# Altium project dspic30f2023_Dev_Board.PrjPcb
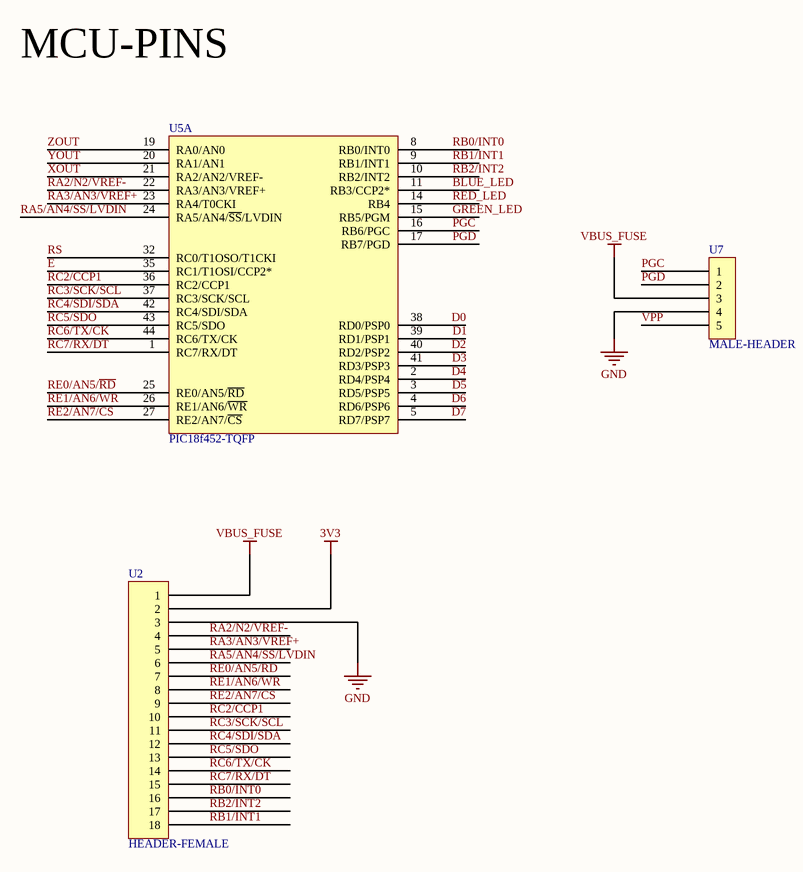
[diagram p0: MCU-PINS.SchDoc]
2 sheets, 24 parts. Net scope: global (net labels, ports and power ports of the same name join across sheets).
Board file: dspic30f2023.PcbDoc
Sheets:
  MCU-PINS.SchDoc
  Sensor&Screen.SchDoc

## Sheet MCU-PINS.SchDoc
size A; SheetNumber: 2; SheetTotal: 3

### Parts
U2  HEADER-FEMALE  [PCBComponent_1]
U5  PIC18f452-TQFP  [PCBComponent_1]  (part A of 2)
U7  MALE-HEADER  [PCBComponent_1]

### Nets
3V3: U2.2
GND: U2.3 U7.4
VBUS_FUSE: U2.1 U7.3
BLUE_LED: U5.11(RB3/CCP2*)
D0: U5.38(RD0/PSP0)
D1: U5.39(RD1/PSP1)
D2: U5.40(RD2/PSP2)
D3: U5.41(RD3/PSP3)
D4: U5.2(RD4/PSP4)
D5: U5.3(RD5/PSP5)
D6: U5.4(RD6/PSP6)
D7: U5.5(RD7/PSP7)
E: U5.35(RC1/T1OSI/CCP2*)
GREEN_LED: U5.15(RB5/PGM)
PGC: U5.16(RB6/PGC) U7.1
PGD: U5.17(RB7/PGD) U7.2
RA2/N2/VREF-: U2.4 U5.22(RA3/AN3/VREF+)
RA3/AN3/VREF+: U2.5 U5.23(RA4/T0CKI)
RA5/AN4/~{SS}/LVDIN: U2.6 U5.24(RA5/AN4/~{SS}/LVDIN)
RB0/INT0: U2.16 U5.8(RB0/INT0)
RB1/INT1: U2.18 U5.9(RB1/INT1)
RB2/INT2: U2.17 U5.10(RB2/INT2)
RC2/CCP1: U2.10 U5.36(RC2/CCP1)
RC3/SCK/SCL: U2.11 U5.37(RC3/SCK/SCL)
RC4/SDI/SDA: U2.12 U5.42(RC4/SDI/SDA)
RC5/SDO: U2.13 U5.43(RC5/SDO)
RC6/TX/CK: U2.14 U5.44(RC6/TX/CK)
RC7/RX/DT: U2.15 U5.1(RC7/RX/DT)
RE0/AN5/~{RD}: U2.7 U5.25(RE0/AN5/~{RD})
RE1/AN6/~{WR}: U2.8 U5.26(RE1/AN6/~{WR})
RE2/AN7/~{CS}: U2.9 U5.27(RE2/AN7/~{CS})
RED_LED: U5.14(RB4)
RS: U5.32(RC0/T1OSO/T1CKI)
VPP: U7.5
XOUT: U5.21(RA2/AN2/VREF-)
YOUT: U5.20(RA1/AN1)
ZOUT: U5.19(RA0/AN0)

### Notes on the sheet
- MCU-PINS

### Library data of the parts
U2 = L-KLS1-208B-4.0-1-18-S
U7 = 5-PINS-MALE-HEADER

## Sheet Sensor&Screen.SchDoc
size A; SheetNumber: 3; SheetTotal: 3
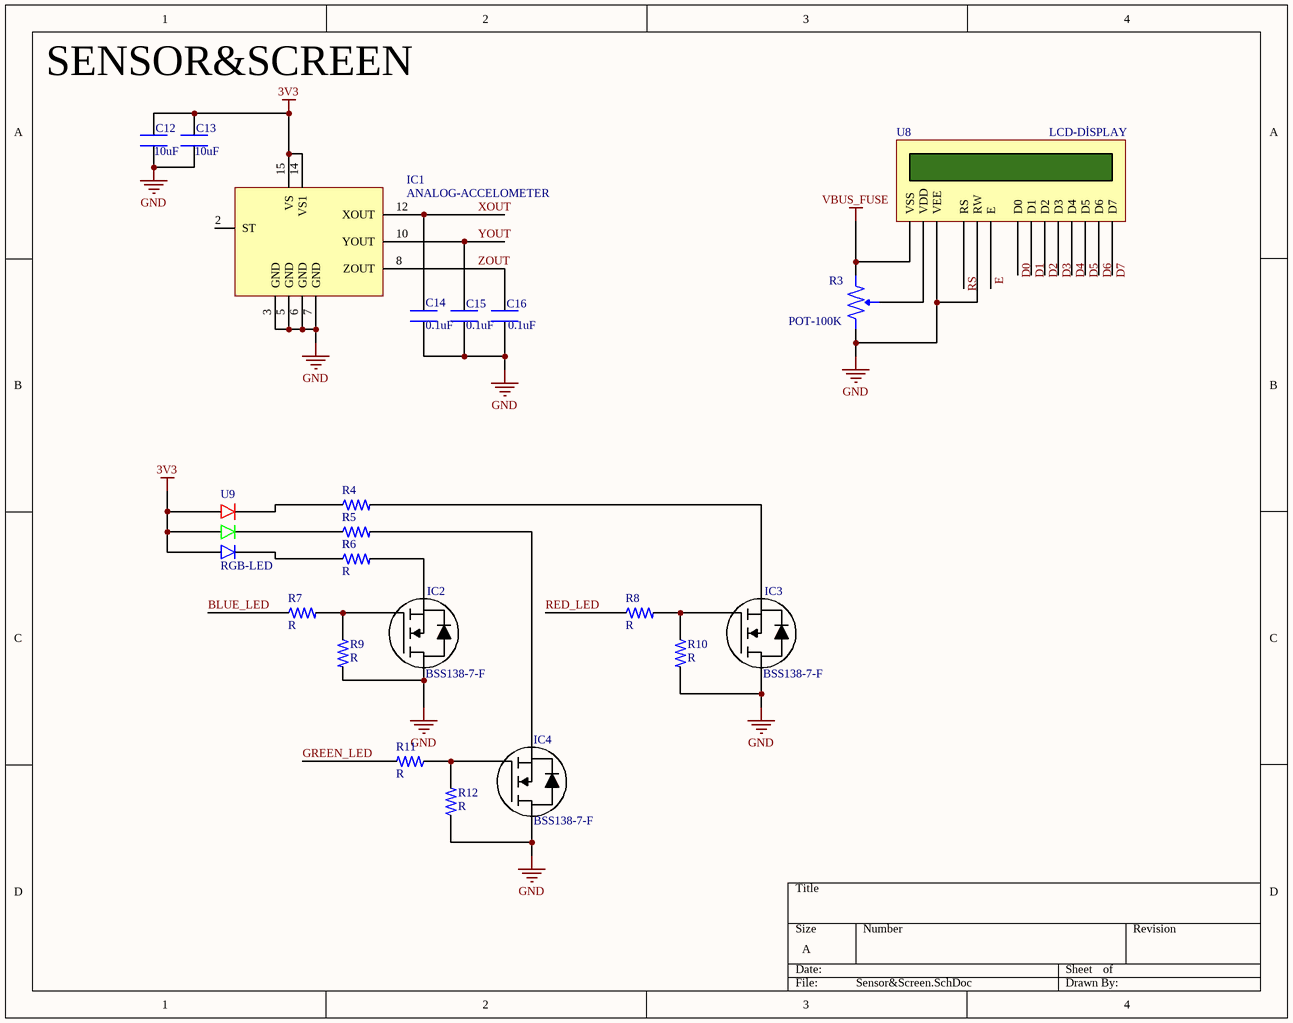
[diagram p1: Sensor&Screen.SchDoc]

### Parts
C12  10uF  [PCBComponent_1]
C13  10uF  [PCBComponent_1]
C14  0.1uF  [PCBComponent_1]
C15  0.1uF  [PCBComponent_1]
C16  0.1uF  [PCBComponent_1]
IC1  ANALOG-ACCELOMETER  [PCBComponent_1]
IC2  BSS138-7-F  [PCBComponent_1]
IC3  BSS138-7-F  [PCBComponent_1]
IC4  BSS138-7-F  [PCBComponent_1]
R3  POT-100K  [PCBComponent_1]
R4  R  [PCBComponent_1]
R5  R  [PCBComponent_1]
R6  R  [PCBComponent_1]
R7  R  [PCBComponent_1]
R8  R  [PCBComponent_1]
R9  R  [PCBComponent_1]
R10  R  [PCBComponent_1]
R11  R  [PCBComponent_1]
R12  R  [PCBComponent_1]
U8  LCD-DİSPLAY  [PCBComponent_1]
U9  RGB-LED  [PCBComponent_1]

### Nets
3V3: C12.2 C13.2 IC1.14(VS1) IC1.15(VS) U9.4(R) U9.5(G) U9.6(B)
GND: C12.1 C13.1 C14.1 C15.1 C16.1 IC1.3(GND) IC1.5(GND) IC1.6(GND) IC1.7(GND) IC2.3(SOURCE) IC3.3(SOURCE) IC4.3(SOURCE) R3.3 R9.2 R10.2 R12.1 U8.3(VEE) U8.5(RW)
VBUS_FUSE: R3.1 U8.1(VSS)
BLUE_LED: R7.1
D0: U8.7(D0)
D1: U8.8(D1)
D2: U8.9(D2)
D3: U8.10(D3)
D4: U8.11(D4)
D5: U8.12(D5)
D6: U8.13(D6)
D7: U8.14(D7)
E: U8.6(E)
GREEN_LED: R11.2
RED_LED: R8.1
RS: U8.4(RS)
XOUT: C14.2 IC1.12(XOUT)
YOUT: C15.2 IC1.10(YOUT)
ZOUT: C16.2 IC1.8(ZOUT)
NetIC2_1: IC2.1(GATE) R7.2 R9.1
NetIC2_2: IC2.2(DRAİN) R6.2
NetIC3_1: IC3.1(GATE) R8.2 R10.1
NetIC3_2: IC3.2(DRAİN) R4.2
NetIC4_1: IC4.1(GATE) R11.1 R12.2
NetIC4_2: IC4.2(DRAİN) R5.2
NetR3_2: R3.2 U8.2(VDD)
NetR4_1: R4.1 U9.3
NetR5_1: R5.1 U9.2
NetR6_1: R6.1 U9.1

Not connected (* = marked no-connect by the designer): IC1 2(ST)

### Notes on the sheet
- SENSOR&SCREEN

### Library data of the parts
C12-C16 = 1206-CAPACİTOR
IC1 = ADXL33X
IC2-IC4 = Component_1
R3 = L-KLS4-R0902N-B100K-L25-
R4-R12 = 1206-RESİSTOR
U8 = 0802A
U9 = FYLS-5050NRGB

## Nets that join several sheets
3V3: MCU-PINS (U2.2), Sensor&Screen (7 pins)
GND: MCU-PINS (U2.3 U7.4), Sensor&Screen (18 pins)
VBUS_FUSE: MCU-PINS (U2.1 U7.3), Sensor&Screen (R3.1 U8.1)
BLUE_LED: MCU-PINS (U5.11), Sensor&Screen (R7.1)
D0: MCU-PINS (U5.38), Sensor&Screen (U8.7)
D1: MCU-PINS (U5.39), Sensor&Screen (U8.8)
D2: MCU-PINS (U5.40), Sensor&Screen (U8.9)
D3: MCU-PINS (U5.41), Sensor&Screen (U8.10)
D4: MCU-PINS (U5.2), Sensor&Screen (U8.11)
D5: MCU-PINS (U5.3), Sensor&Screen (U8.12)
D6: MCU-PINS (U5.4), Sensor&Screen (U8.13)
D7: MCU-PINS (U5.5), Sensor&Screen (U8.14)
E: MCU-PINS (U5.35), Sensor&Screen (U8.6)
GREEN_LED: MCU-PINS (U5.15), Sensor&Screen (R11.2)
RED_LED: MCU-PINS (U5.14), Sensor&Screen (R8.1)
RS: MCU-PINS (U5.32), Sensor&Screen (U8.4)
XOUT: MCU-PINS (U5.21), Sensor&Screen (C14.2 IC1.12)
YOUT: MCU-PINS (U5.20), Sensor&Screen (C15.2 IC1.10)
ZOUT: MCU-PINS (U5.19), Sensor&Screen (C16.2 IC1.8)